# Altium schematic sheet PowerBoard.SchDoc
size A4
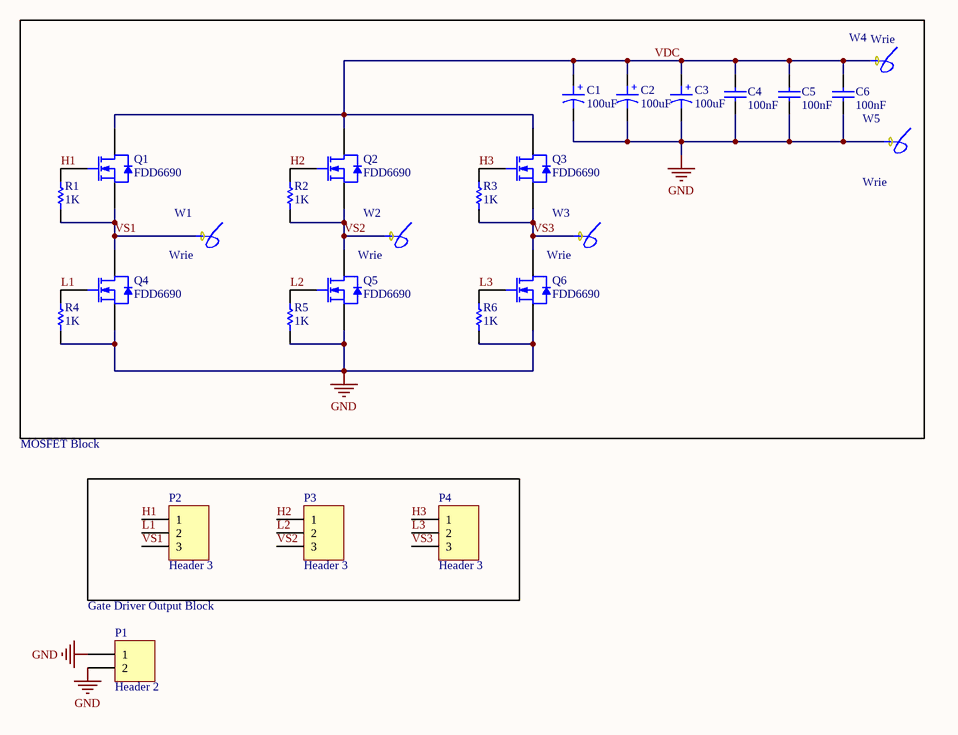
[diagram p0: PowerBoard.SchDoc]

## Parts
C1  100uF  [Cap electrolitic radial 6.3x12-2.5]
C2  100uF  [Cap electrolitic radial 6.3x12-2.5]
C3  100uF  [Cap electrolitic radial 6.3x12-2.5]
C4  100nF  [Cap-100nF]
C5  100nF  [Cap-100nF]
C6  100nF  [Cap-100nF]
P1  Header 2  [HDR1X2]
P2  Header 3  [HDR1X3]
P3  Header 3  [HDR1X3]
P4  Header 3  [HDR1X3]
Q1  FDD6690  [TO252-3L]
Q2  FDD6690  [TO252-3L]
Q3  FDD6690  [TO252-3L]
Q4  FDD6690  [TO252-3L]
Q5  FDD6690  [TO252-3L]
Q6  FDD6690  [TO252-3L]
R1  1K  [RES-(1/4)]
R2  1K  [RES-(1/4)]
R3  1K  [RES-(1/4)]
R4  1K  [RES-(1/4)]
R5  1K  [RES-(1/4)]
R6  1K  [RES-(1/4)]
W1  Diameter: Wrie  [wire 1.5 mm]  (hidden comment: *)
W2  Diameter: Wrie  [wire 1.5 mm]  (hidden comment: *)
W3  Diameter: Wrie  [wire 1.5 mm]  (hidden comment: *)
W4  Diameter: Wrie  [wire 1.5 mm]  (hidden comment: *)
W5  Diameter: Wrie  [wire 1.5 mm]  (hidden comment: *)

## Nets
GND: C1.2 C2.2 C3.2 C4.1 C5.1 C6.1 P1.1 P1.2 Q4.3(S) Q5.3(S) Q6.3(S) R4.2 R5.2 R6.2 W5.1
H1: P2.1 Q1.1(G) R1.1
H2: P3.1 Q2.1(G) R2.1
H3: P4.1 Q3.1(G) R3.1
L1: P2.2 Q4.1(G) R4.1
L2: P3.2 Q5.1(G) R5.1
L3: P4.2 Q6.1(G) R6.1
VDC: C1.1 C2.1 C3.1 C4.2 C5.2 C6.2 Q1.4(D) Q2.4(D) Q3.4(D) W4.1
VS1: P2.3 Q1.3(S) Q4.4(D) R1.2 W1.1
VS2: P3.3 Q2.3(S) Q5.4(D) R2.2 W2.1
VS3: P4.3 Q3.3(S) Q6.4(D) R3.2 W3.1

## Notes on the sheet
- MOSFET Block
- Gate Driver Output Block
- (in symbol Cap ELECTROLITIC TOTAL SIZE) +

## Library data of the parts
C1-C3 = Cap ELECTROLITIC TOTAL SIZE: Cap electrolitic radial; Designer: Abbas Basereh; VALUE: 1uF; Data: 16-12-2016; Part. No: *
C4-C6 = CAP CERAMIC TOTAL SIZE: CAP Ceramic Total; Designer: Ali Hafizi
P1 = Header 2: Header, 2-Pin; LatestRevisionDate: 17-Jul-2002; LatestRevisionNote: Re-released for DXP Platform.; Publisher: Altium Limited
P2-P4 = Header 3: Header, 3-Pin; LatestRevisionDate: 17-Jul-2002; LatestRevisionNote: Re-released for DXP Platform.; Publisher: Altium Limited
Q1-Q6 = P0903BDG: N-channel MOSFET; Note: Pin 2 is trimmed (and not drawn) and is electrically connected to Drain; Published: 2017-1-12; DatasheetVersion: 2017-1-12; PackageVersion: 2017-1-12; PackageReference: D-PAK TO-252; Publisher: Abbas Basereh; PackageDescription: D-PAK TO-252; ComponentLink1Description: Manufacturer Link; ComponentLink2Description: Datasheet; ComponentLink2URL: http://www.roboeq.ir/files/id/2909/name/P0903BDG.pdf/
R1-R6 = RES DIP PACKAGE: TOTAL DIP RESISTOR PACK; Designer: Ali Hafizi
W1-W5 = Single Wire: A Customize Component For Single Wire Connection; Designer: Saeid Jorablo; Company: IPA Co; Adding Date: 1388/04/05; Color: Blue; Wire Name: *